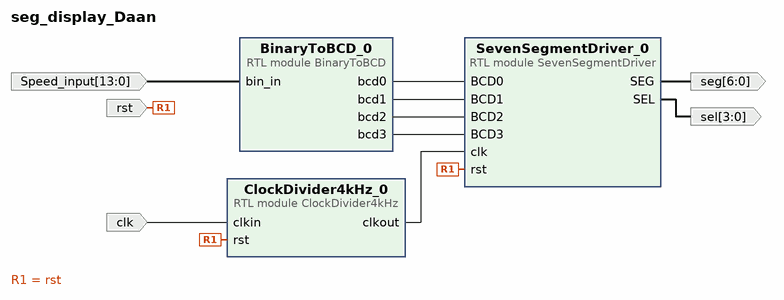
[diagram p0: block diagram of the top level]
# Vivado block design seg_display_Daan, xc7z020clg400-1, Vivado 2023.1
create_bd_design seg_display_Daan

create_bd_port -dir I clk
create_bd_port -dir O -from 6 -to 0 seg
create_bd_port -dir O -from 3 -to 0 sel
create_bd_port -dir I -from 13 -to 0 Speed_input
create_bd_port -dir I rst

create_bd_cell -type module -reference BinaryToBCD BinaryToBCD_0
create_bd_cell -type module -reference SevenSegmentDriver SevenSegmentDriver_0
create_bd_cell -type module -reference ClockDivider4kHz ClockDivider4kHz_0

# ---- connections ----

connect_bd_net [get_bd_pins BinaryToBCD_0/bcd0] [get_bd_pins SevenSegmentDriver_0/BCD0]
connect_bd_net [get_bd_pins BinaryToBCD_0/bcd1] [get_bd_pins SevenSegmentDriver_0/BCD1]
connect_bd_net [get_bd_pins BinaryToBCD_0/bcd2] [get_bd_pins SevenSegmentDriver_0/BCD2]
connect_bd_net [get_bd_pins BinaryToBCD_0/bcd3] [get_bd_pins SevenSegmentDriver_0/BCD3]
connect_bd_net [get_bd_pins ClockDivider4kHz_0/clkout] [get_bd_pins SevenSegmentDriver_0/clk]
connect_bd_net [get_bd_pins SevenSegmentDriver_0/SEG] [get_bd_ports seg]
connect_bd_net [get_bd_pins SevenSegmentDriver_0/SEL] [get_bd_ports sel]
connect_bd_net [get_bd_ports Speed_input] [get_bd_pins BinaryToBCD_0/bin_in]
connect_bd_net [get_bd_ports clk] [get_bd_pins ClockDivider4kHz_0/clkin]
connect_bd_net [get_bd_ports rst] [get_bd_pins ClockDivider4kHz_0/rst] [get_bd_pins SevenSegmentDriver_0/rst]

validate_bd_design
save_bd_design
